# Altium project UU001_UUControl.PrjPcb
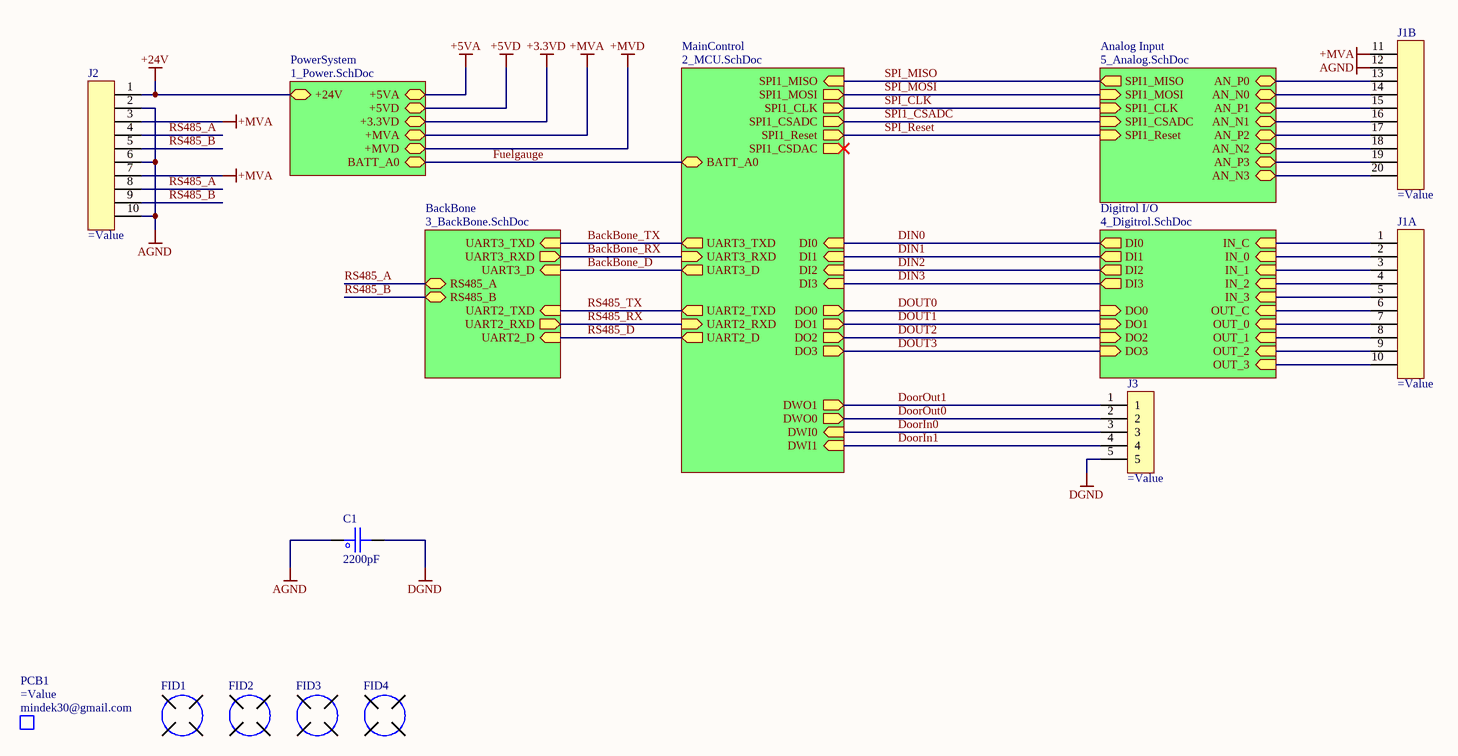
[diagram p0: 0_Overview.SchDoc]
PCB_Name: UU Control Board; PCB_PN: UU001; PCB_Rev: A1; PCBA_PN: UU001; PCBA_Rev: A1
6 sheets, 204 parts. Net scope: hierarchical (ports join the sheet entries above them; power ports are global).
Board file: UU001_UUControl.PcbDoc
Sheets:
  0_Overview.SchDoc
    MainControl = 2_MCU.SchDoc
    Analog Input = 5_Analog.SchDoc
    Digitrol I/O = 4_Digitrol.SchDoc
    PowerSystem = 1_Power.SchDoc
    BackBone = 3_BackBone.SchDoc

## Sheet 0_Overview.SchDoc: Overview
size A3; DocumentNumber: 1; SheetNumber: 1; SheetTotal: 6; PageSetup: Record=PageOptions|CenterHorizontal=True|CenterVertical=True|PrintScale=1.01|XCorrection=1.00|YCorrection=1.00|PrintKind=0|BorderSize=5000000|LeftOffset=0|BottomOffset=0|Orientation=2|PaperLength=1000|PaperWidth=1000|Scale=100|PaperSource=7|PrintQuality=-4|MediaType=1|DitherType=10|PaperKind=A3|PrintScaleMode=1

### Parts
C1  2200pF  [C_1206]
FID1  FIDUCIAL  [FID]  (value not drawn)  (no BOM)
FID2  FIDUCIAL  [FID]  (value not drawn)  (no BOM)
FID3  FIDUCIAL  [FID]  (value not drawn)  (no BOM)
FID4  FIDUCIAL  [FID]  (value not drawn)  (no BOM)
J1  (no value)  [CON_20P_Terminal]  (parts A,B of 2)
J2  (no value)  [CON_10P_Terminal]
J3  (no value)  [MOLEX_532610571]
PCB1  Manufacturer: mindek30@gmail.com  (mechanical)

### Sub-sheets
Analog Input = 5_Analog.SchDoc: SPI1_MISO (out), SPI1_MOSI (in), SPI1_CLK (in), SPI1_CSADC (in), SPI1_Reset (in), AN_P0 (bidir), AN_P1 (bidir), AN_P2 (bidir), AN_P3 (bidir), AN_N0 (bidir), AN_N1 (bidir), AN_N2 (bidir), AN_N3 (bidir)
BackBone = 3_BackBone.SchDoc: UART3_D (in), UART2_TXD (in), UART2_RXD (out), UART2_D (in), UART3_TXD (in), UART3_RXD (out), RS485_A (bidir), RS485_B (bidir)
Digitrol I/O = 4_Digitrol.SchDoc: DI0 (out), DI1 (out), DI2 (out), DI3 (out), DO0 (in), DO1 (in), DO2 (in), DO3 (in), IN_0 (in), IN_1 (in), IN_2 (in), IN_3 (in), OUT_0 (in), OUT_1 (in), OUT_2 (in), OUT_3 (in), OUT_C (in), IN_C (in)
MainControl = 2_MCU.SchDoc: SPI1_MISO (in), SPI1_MOSI (out), SPI1_CLK (out), DI0 (in), DI1 (in), DI2 (in), DI3 (in), DO0 (out), DO1 (out), DO2 (out), DO3 (out), SPI1_Reset (out), UART3_TXD (out), UART3_RXD (in), UART3_D (out), UART2_TXD (out), UART2_RXD (in), UART2_D (out), BATT_A0 (bidir), SPI1_CSADC (out), SPI1_CSDAC (out), DWO0 (out), DWI1 (in), DWI0 (in), DWO1 (out)
PowerSystem = 1_Power.SchDoc: +5VA (bidir), +24V (bidir), +3.3VD (bidir), +MVA (bidir), +MVD (bidir), BATT_A0 (bidir), +5VD (bidir)

### Nets
+24V: J2.1 ; sheet PowerSystem/+24V
+MVA: J1.11 J2.3 J2.7 ; sheet PowerSystem/+MVA
AGND: C1.1 J1.12 J2.2 J2.6 J2.10
DGND: C1.2 J3.5
BackBone_D: sheet MainControl/UART3_D, sheet BackBone/UART3_D
BackBone_RX: sheet MainControl/UART3_RXD, sheet BackBone/UART3_RXD
BackBone_TX: sheet MainControl/UART3_TXD, sheet BackBone/UART3_TXD
DIN0: sheet MainControl/DI0, sheet Digitrol I/O/DI0
DIN1: sheet MainControl/DI1, sheet Digitrol I/O/DI1
DIN2: sheet MainControl/DI2, sheet Digitrol I/O/DI2
DIN3: sheet MainControl/DI3, sheet Digitrol I/O/DI3
DoorIn0: J3.3 ; sheet MainControl/DWI0
DoorIn1: J3.4 ; sheet MainControl/DWI1
DoorOut0: J3.2 ; sheet MainControl/DWO0
DoorOut1: J3.1 ; sheet MainControl/DWO1
DOUT0: sheet MainControl/DO0, sheet Digitrol I/O/DO0
DOUT1: sheet MainControl/DO1, sheet Digitrol I/O/DO1
DOUT2: sheet MainControl/DO2, sheet Digitrol I/O/DO2
DOUT3: sheet MainControl/DO3, sheet Digitrol I/O/DO3
Fuelgauge: sheet MainControl/BATT_A0, sheet PowerSystem/BATT_A0
INCom: J1.1 ; sheet Digitrol I/O/IN_C
INPUT0: J1.2 ; sheet Digitrol I/O/IN_0
INPUT1: J1.3 ; sheet Digitrol I/O/IN_1
INPUT2: J1.4 ; sheet Digitrol I/O/IN_2
INPUT3: J1.5 ; sheet Digitrol I/O/IN_3
OUTCom: J1.6 ; sheet Digitrol I/O/OUT_C
OUTPUT0: J1.7 ; sheet Digitrol I/O/OUT_0
OUTPUT1: J1.8 ; sheet Digitrol I/O/OUT_1
OUTPUT2: J1.9 ; sheet Digitrol I/O/OUT_2
OUTPUT3: J1.10 ; sheet Digitrol I/O/OUT_3
RS485_A: J2.4 J2.8 ; sheet BackBone/RS485_A
RS485_B: J2.5 J2.9 ; sheet BackBone/RS485_B
RS485_D: sheet MainControl/UART2_D, sheet BackBone/UART2_D
RS485_RX: sheet MainControl/UART2_RXD, sheet BackBone/UART2_RXD
RS485_TX: sheet MainControl/UART2_TXD, sheet BackBone/UART2_TXD
SPI1_CSADC: sheet MainControl/SPI1_CSADC, sheet Analog Input/SPI1_CSADC
SPI_CLK: sheet MainControl/SPI1_CLK, sheet Analog Input/SPI1_CLK  [project net SPI1_SCK]
SPI_MISO: sheet MainControl/SPI1_MISO, sheet Analog Input/SPI1_MISO  [project net SPI1_MISO]
SPI_MOSI: sheet MainControl/SPI1_MOSI, sheet Analog Input/SPI1_MOSI  [project net SPI1_MOSI]
SPI_Reset: sheet MainControl/SPI1_Reset, sheet Analog Input/SPI1_Reset
NetJ1_13: J1.13 ; sheet Analog Input/AN_P0
NetJ1_14: J1.14 ; sheet Analog Input/AN_N0
NetJ1_15: J1.15 ; sheet Analog Input/AN_P1
NetJ1_16: J1.16 ; sheet Analog Input/AN_N1
NetJ1_17: J1.17 ; sheet Analog Input/AN_P2
NetJ1_18: J1.18 ; sheet Analog Input/AN_N2
NetJ1_19: J1.19 ; sheet Analog Input/AN_P3
NetJ1_20: J1.20 ; sheet Analog Input/AN_N3

### Notes on the sheet
- Title :
- Revision :
- ผู้จัดทำ:
- Size:
- A3
- Time:
- ผู้เขียน:
- บริษัท ยูนิเวอร์แซล ยูทีลิตี้ส์ จำกัด (มหาชน) เลขที่ 1 อาคาร อีสท์วอเตอร์ ชั้น 18 ซอยวิภาวดีรังสิต 5 แขวงจอมพล เขตจตุจักร กรุงเทพฯ 10900
  Tel : +662-272-1688
  Fax :+662-2721690-1
- -
- Sheet:
- of
- ผู้อำนวยการ
- ผู้ตรวจสอบ:
- Number:
- กรรมการผู้จัดการ:
- File:

### Library data of the parts
C1 = C_Capacitor: CAP CER 2200PF 1KV X7R 1206; Manufacturer: AVX Corporation; PartNumber: 1206AC222KAT1A; PackageReference: 1206; PartID: 478-2953-1-ND; Value2: 1kV; Value: 2200pF; Value3: *
FID1-FID4 = FID_FIDUCIAL: Manufacturer: mindek30@gmail.com; PartNumber: UU001_A1; Value2: Non SE; Value: Non SE; PartID: A1; PackageReference: Non SE; Value3: Non SE
J1 = CON_20P_Terminal: TERM BLOCK HDR 20POS 90DEG 3.5MM; PartNumber: KF2EDGK-20P; Value: KF2EDGK-20P; Value3: 1966172; PartID: KF2EDGK-20P; Manufacturer: *; PackageReference: *; Value2: *
J2 = CON_10P_Terminal: TERM BLOCK HDR 10POS 90DEG 3.5MM; PartNumber: KF2EDGK-10P; Value: KF2EDGK-10P; Value3: 1966172; PartID: KF2EDGK-10P; Manufacturer: *; PackageReference: *; Value2: *
J3 = CON_5P_532610571: CONN HEADER SMD R/A 5POS 1.25MM; PartNumber: 0532610571; Manufacturer: Molex; Value: 0532610571; Value2: AFC12-S05DCC-00; PartID: WM7623CT-ND; PackageReference: 5P; Value3: *
PCB1 = PCB_Bare: BARE PCB; PartNumber: UU001_A1; PackageReference: Non SE; PartID: A1; Value2: =JobFile_Title; Value: =PartNumber; Value3: UU001_A1

## Sheet 2_MCU.SchDoc
size A3; DocumentNumber: 3; SheetNumber: 3; SheetTotal: 6; PageSetup: Record=PageOptions|CenterHorizontal=True|CenterVertical=True|PrintScale=1.01|XCorrection=1.00|YCorrection=1.00|PrintKind=0|BorderSize=5000000|LeftOffset=0|BottomOffset=0|Orientation=2|PaperLength=1000|PaperWidth=1000|Scale=100|PaperSource=7|PrintQuality=-4|MediaType=1|DitherType=10|PaperKind=A3|PrintScaleMode=1
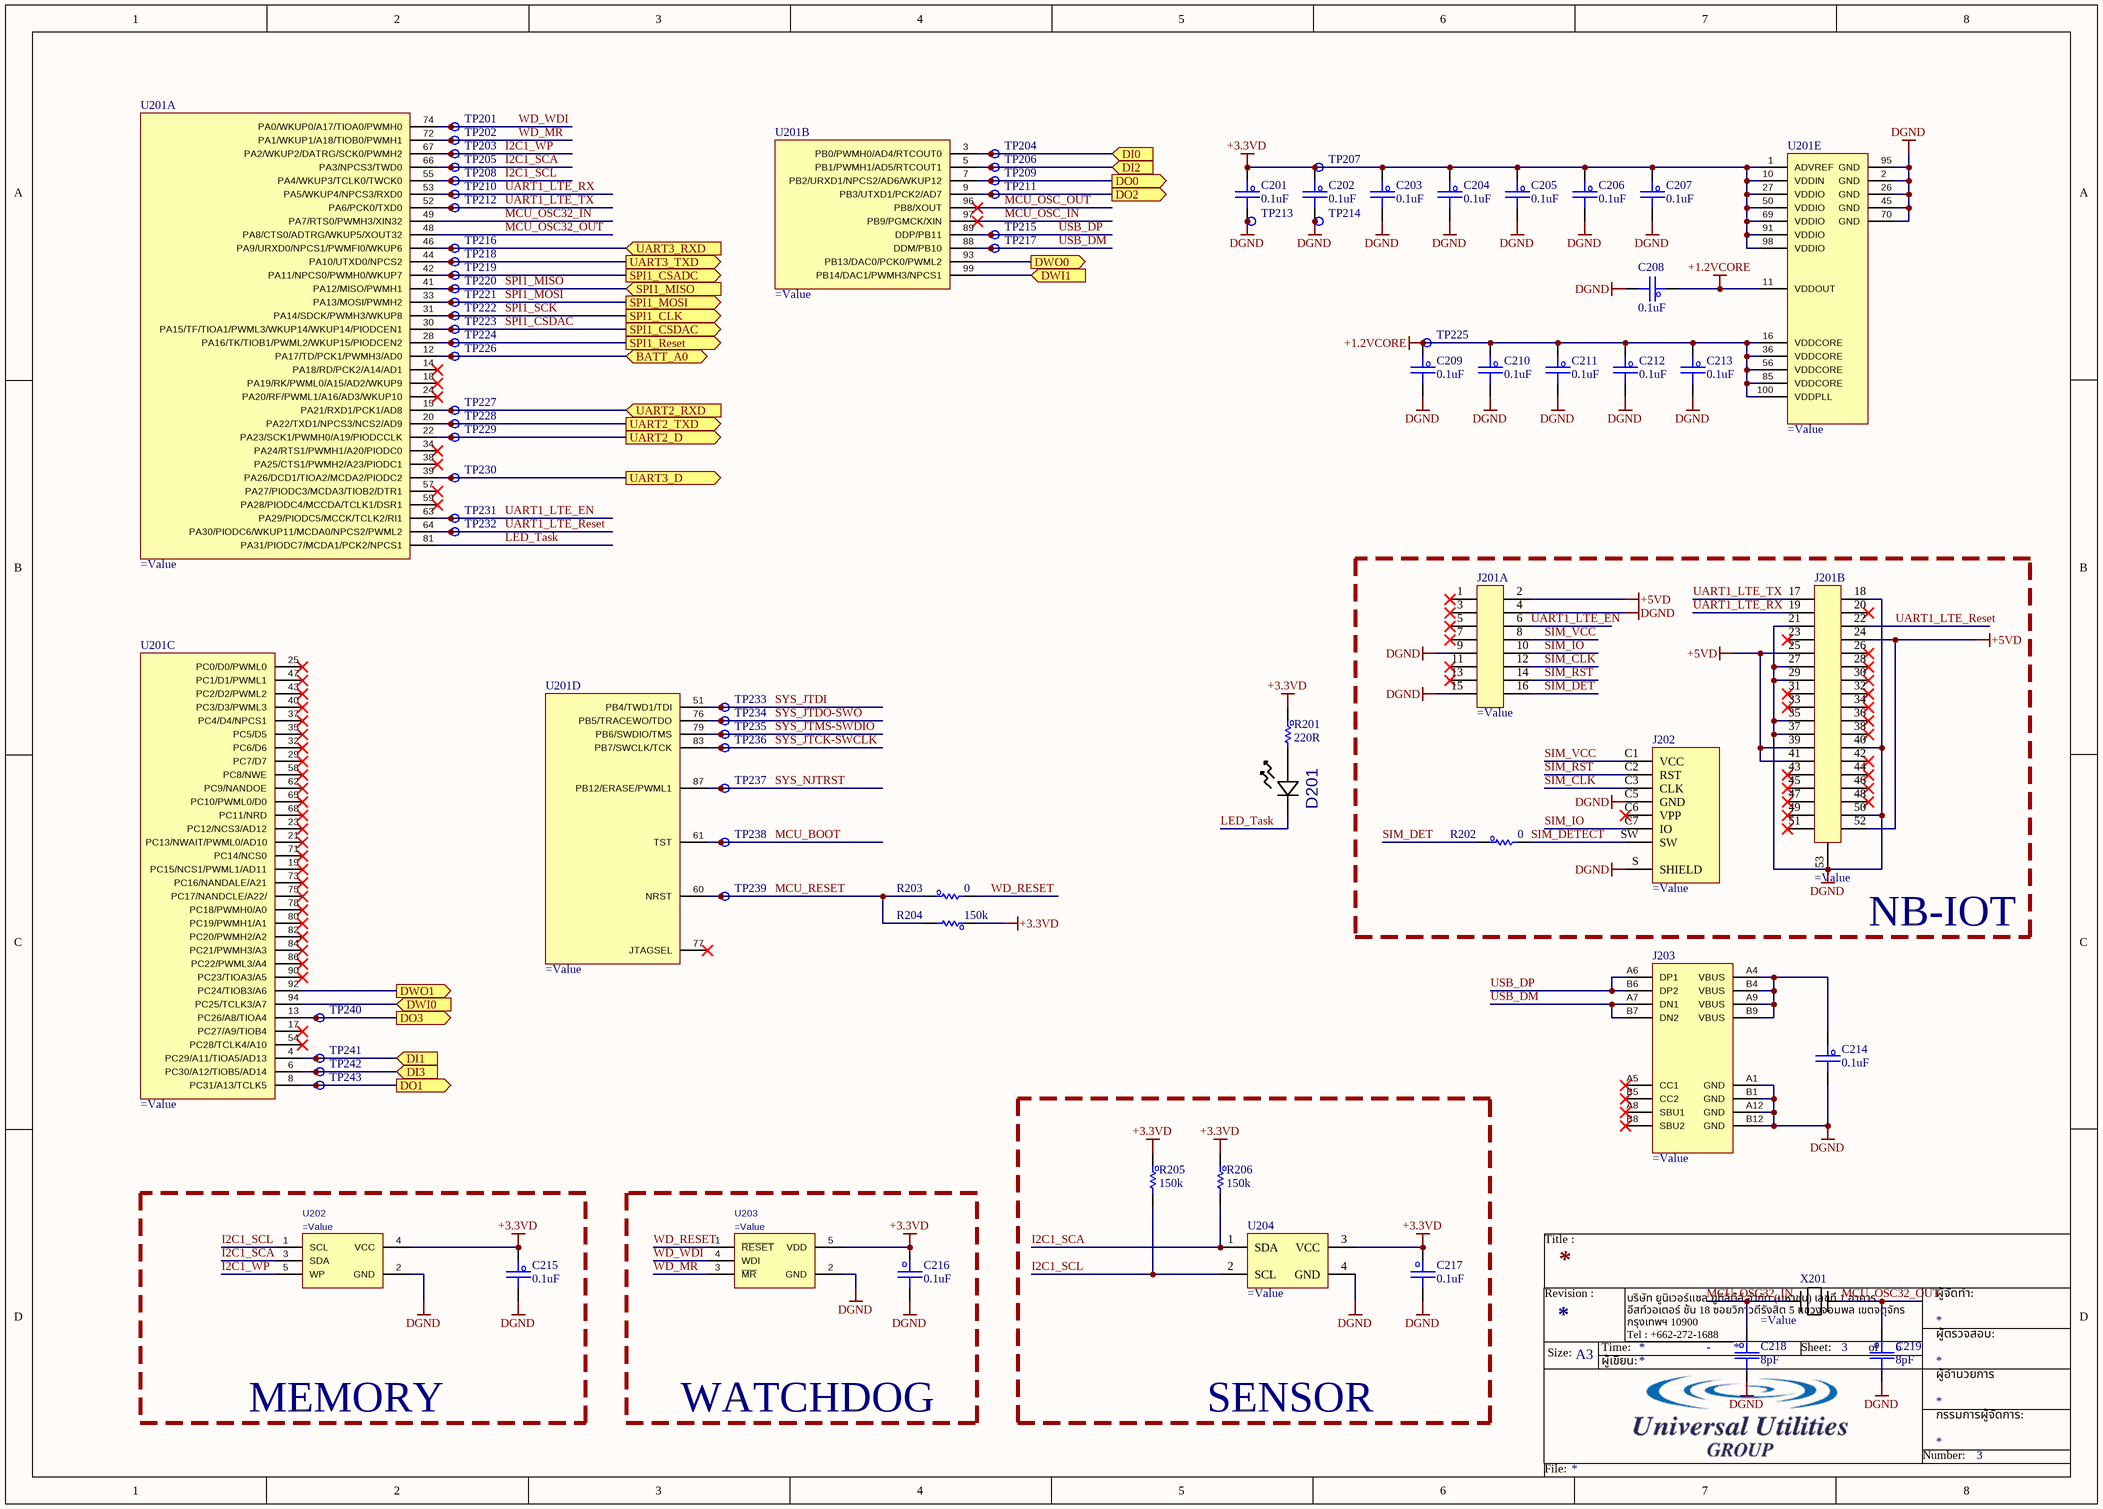
[diagram p1: 2_MCU.SchDoc]

### Parts
C201  0.1uF  [C_0603]
C202  0.1uF  [C_0603]
C203  0.1uF  [C_0603]
C204  0.1uF  [C_0603]
C205  0.1uF  [C_0603]
C206  0.1uF  [C_0603]
C207  0.1uF  [C_0603]
C208  0.1uF  [C_0603]
C209  0.1uF  [C_0603]
C210  0.1uF  [C_0603]
C211  0.1uF  [C_0603]
C212  0.1uF  [C_0603]
C213  0.1uF  [C_0603]
C214  0.1uF  [C_0603]
C215  0.1uF  [C_0603]
C216  0.1uF  [C_0603]
C217  0.1uF  [C_0603]
C218  8pF  [C_0603]  (no BOM)
C219  8pF  [C_0603]  (no BOM)
D201  (no value)  [LED_0VS75000_WRE]
J201  (no value)  [TE_2041119-1]  (parts A,B of 2)
J202  (no value)  [SIM8060-6-1-14-00-A_REVA]
J203  (no value)  [2137160001_MOL_2137160001(Primary)]
R201  220R  [R_0603]
R202  0  [R_0603]
R203  0  [R_0603]
R204  150k  [R_0603]
R205  150k  [R_0603]
R206  150k  [R_0603]
TP201  (no value)  [TP_Testpoint]  (no BOM)
TP202  (no value)  [TP_Testpoint]  (no BOM)
TP203  (no value)  [TP_Testpoint]  (no BOM)
TP204  (no value)  [TP_Testpoint]  (no BOM)
TP205  (no value)  [TP_Testpoint]  (no BOM)
TP206  (no value)  [TP_Testpoint]  (no BOM)
TP207  (no value)  [TP_Testpoint]  (no BOM)
TP208  (no value)  [TP_Testpoint]  (no BOM)
TP209  (no value)  [TP_Testpoint]  (no BOM)
TP210  (no value)  [TP_Testpoint]  (no BOM)
TP211  (no value)  [TP_Testpoint]  (no BOM)
TP212  (no value)  [TP_Testpoint]  (no BOM)
TP213  (no value)  [TP_Testpoint]  (no BOM)
TP214  (no value)  [TP_Testpoint]  (no BOM)
TP215  (no value)  [TP_Testpoint]  (no BOM)
TP216  (no value)  [TP_Testpoint]  (no BOM)
TP217  (no value)  [TP_Testpoint]  (no BOM)
TP218  (no value)  [TP_Testpoint]  (no BOM)
TP219  (no value)  [TP_Testpoint]  (no BOM)
TP220  (no value)  [TP_Testpoint]  (no BOM)
TP221  (no value)  [TP_Testpoint]  (no BOM)
TP222  (no value)  [TP_Testpoint]  (no BOM)
TP223  (no value)  [TP_Testpoint]  (no BOM)
TP224  (no value)  [TP_Testpoint]  (no BOM)
TP225  (no value)  [TP_Testpoint]  (no BOM)
TP226  (no value)  [TP_Testpoint]  (no BOM)
TP227  (no value)  [TP_Testpoint]  (no BOM)
TP228  (no value)  [TP_Testpoint]  (no BOM)
TP229  (no value)  [TP_Testpoint]  (no BOM)
TP230  (no value)  [TP_Testpoint]  (no BOM)
TP231  (no value)  [TP_Testpoint]  (no BOM)
TP232  (no value)  [TP_Testpoint]  (no BOM)
TP233  (no value)  [TP_Testpoint]  (no BOM)
TP234  (no value)  [TP_Testpoint]  (no BOM)
TP235  (no value)  [TP_Testpoint]  (no BOM)
TP236  (no value)  [TP_Testpoint]  (no BOM)
TP237  (no value)  [TP_Testpoint]  (no BOM)
TP238  (no value)  [TP_Testpoint]  (no BOM)
TP239  (no value)  [TP_Testpoint]  (no BOM)
TP240  (no value)  [TP_Testpoint]  (no BOM)
TP241  (no value)  [TP_Testpoint]  (no BOM)
TP242  (no value)  [TP_Testpoint]  (no BOM)
TP243  (no value)  [TP_Testpoint]  (no BOM)
U201  (no value)  [TQFP100_14X14M00]  (parts A,B,C,D,E of 5)
U202  (no value)  [SOT65P210X110-5N]
U203  (no value)  [DBV5]
U204  (no value)  [XDCR_SHT40-AD1B-R2]
X201  (no value)  [XTAL_CM315D_CF00]  (no BOM)

### Blocks framed on the sheet
NB-IOT: J201 J202 R202
SENSOR: C217 R205 R206 U204
MEMORY: C215 U202
WATCHDOG: C216 U203

### Ports
BATT_A0 (bidir), DI0 (in), DI1 (in), DI2 (in), DI3 (in), DO0 (out), DO1 (out), DO2 (out), DO3 (out), DWI0 (in), DWI1 (in), DWO0 (out), DWO1 (out), SPI1_CLK (out), SPI1_CSADC (out), SPI1_CSDAC (out), SPI1_MISO (in), SPI1_MOSI (out), SPI1_Reset (out), UART2_D (out), UART2_RXD (in), UART2_TXD (out), UART3_D (out), UART3_RXD (in), UART3_TXD (out)

### Nets
+1.2VCORE: C208.1 C209.1 C210.1 C211.1 C212.1 C213.1 TP225.1 U201.11(VDDOUT) U201.16(VDDCORE) U201.36(VDDCORE) U201.56(VDDCORE) U201.85(VDDCORE) U201.100(VDDPLL)
+3.3VD: C201.1 C202.1 C203.1 C204.1 C205.1 C206.1 C207.1 C215.1 C216.1 C217.1 R201.1 R204.1 R205.1 R206.1 TP207.1 U201.1(ADVREF) U201.10(VDDIN) U201.27(VDDIO) U201.50(VDDIO) U201.69(VDDIO) U201.91(VDDIO) U201.98(VDDIO) U202.4(VCC) U203.5(VDD) U204.3(VCC)
+5VD: J201.2 J201.24 J201.25 J201.39 J201.41 J201.52
DGND: C201.2 C202.2 C203.2 C204.2 C205.2 C206.2 C207.2 C208.2 C209.2 C210.2 C211.2 C212.2 C213.2 C214.2 C215.2 C216.2 C217.2 C218.2 C219.2 J201.4 J201.9 J201.15 J201.18 J201.21 J201.27 J201.29 J201.35 J201.37 J201.40 J201.50 J201.53 J202.C5(GND) J202.S(SHIELD) J203.A1(GND) J203.A12(GND) J203.B1(GND) J203.B12(GND) TP213.1 TP214.1 U201.2(GND) U201.26(GND) U201.45(GND) U201.70(GND) U201.95(GND) U202.2(GND) U203.2(GND) U204.4(GND)
BackBone_D: TP230.1 U201.39(PA26/DCD1/TIOA2/MCDA2/PIODC2) ; port UART3_D
BackBone_RX: TP216.1 U201.46(PA9/URXD0/NPCS1/PWMFI0/WKUP6) ; port UART3_RXD
BackBone_TX: TP218.1 U201.44(PA10/UTXD0/NPCS2) ; port UART3_TXD
DIN0: TP204.1 U201.3(PB0/PWMH0/AD4/RTCOUT0) ; port DI0
DIN1: TP241.1 U201.4(PC29/A11/TIOA5/AD13) ; port DI1
DIN2: TP206.1 U201.5(PB1/PWMH1/AD5/RTCOUT1) ; port DI2
DIN3: TP242.1 U201.6(PC30/A12/TIOB5/AD14) ; port DI3
DoorIn0: U201.94(PC25/TCLK3/A7) ; port DWI0
DoorIn1: U201.99(PB14/DAC1/PWMH3/NPCS1) ; port DWI1
DoorOut0: U201.93(PB13/DAC0/PCK0/PWML2) ; port DWO0
DoorOut1: U201.92(PC24/TIOB3/A6) ; port DWO1
DOUT0: TP209.1 U201.7(PB2/URXD1/NPCS2/AD6/WKUP12) ; port DO0
DOUT1: TP243.1 U201.8(PC31/A13/TCLK5) ; port DO1
DOUT2: TP211.1 U201.9(PB3/UTXD1/PCK2/AD7) ; port DO2
DOUT3: TP240.1 U201.13(PC26/A8/TIOA4) ; port DO3
Fuelgauge: TP226.1 U201.12(PA17/TD/PCK1/PWMH3/AD0) ; port BATT_A0
I2C1_SCA: R206.2 TP205.1 U201.66(PA3/NPCS3/TWD0) U202.3(SDA) U204.1(SDA)
I2C1_SCL: R205.2 TP208.1 U201.55(PA4/WKUP3/TCLK0/TWCK0) U202.1(SCL) U204.2(SCL)
I2C1_WP: TP203.1 U201.67(PA2/WKUP2/DATRG/SCK0/PWMH2) U202.5(WP)
LED_Task: D201.1 U201.81(PA31/PIODC7/MCDA1/PCK2/NPCS1)
MCU_BOOT: TP238.1 U201.61(TST)
MCU_OSC32_IN: C218.1 U201.49(PA7/RTS0/PWMH3/XIN32) X201.1
MCU_OSC32_OUT: C219.1 U201.48(PA8/CTS0/ADTRG/WKUP5/XOUT32) X201.2
MCU_OSC_IN: U201.97(PB9/PGMCK/XIN)
MCU_OSC_OUT: U201.96(PB8/XOUT)
MCU_RESET: R203.1 R204.2 TP239.1 U201.60(NRST)
RS485_D: TP229.1 U201.22(PA23/SCK1/PWMH0/A19/PIODCCLK) ; port UART2_D
RS485_RX: TP227.1 U201.15(PA21/RXD1/PCK1/AD8) ; port UART2_RXD
RS485_TX: TP228.1 U201.20(PA22/TXD1/NPCS3/NCS2/AD9) ; port UART2_TXD
SIM_CLK: J201.12 J202.C3(CLK)
SIM_DET: J201.16 R202.1
SIM_DETECT: J202.SW R202.2
SIM_IO: J201.10 J202.C7(IO)
SIM_RST: J201.14 J202.C2(RST)
SIM_VCC: J201.8 J202.C1(VCC)
SPI1_CSADC: TP219.1 U201.42(PA11/NPCS0/PWMH0/WKUP7) ; port SPI1_CSADC
SPI1_CSDAC: TP223.1 U201.30(PA15/TF/TIOA1/PWML3/WKUP14/WKUP14/PIODCEN1) ; port SPI1_CSDAC
SPI1_MISO: TP220.1 U201.41(PA12/MISO/PWMH1) ; port SPI1_MISO
SPI1_MOSI: TP221.1 U201.33(PA13/MOSI/PWMH2) ; port SPI1_MOSI
SPI1_SCK: TP222.1 U201.31(PA14/SDCK/PWMH3/WKUP8) ; port SPI1_CLK
SPI_Reset: TP224.1 U201.28(PA16/TK/TIOB1/PWML2/WKUP15/PIODCEN2) ; port SPI1_Reset
SYS_JTCK-SWCLK: TP236.1 U201.83(PB7/SWCLK/TCK)
SYS_JTDI: TP233.1 U201.51(PB4/TWD1/TDI)
SYS_JTDO-SWO: TP234.1 U201.76(PB5/TRACEWO/TDO)
SYS_JTMS-SWDIO: TP235.1 U201.79(PB6/SWDIO/TMS)
SYS_NJTRST: TP237.1 U201.87(PB12/ERASE/PWML1)
UART1_LTE_EN: J201.6 TP231.1 U201.63(PA29/PIODC5/MCCK/TCLK2/RI1)
UART1_LTE_Reset: J201.22 TP232.1 U201.64(PA30/PIODC6/WKUP11/MCDA0/NPCS2/PWML2)
UART1_LTE_RX: J201.19 TP210.1 U201.53(PA5/WKUP4/NPCS3/RXD0)
UART1_LTE_TX: J201.17 TP212.1 U201.52(PA6/PCK0/TXD0)
USB_DM: J203.A7(DN1) J203.B7(DN2) TP217.1 U201.88(DDM/PB10)
USB_DP: J203.A6(DP1) J203.B6(DP2) TP215.1 U201.89(DDP/PB11)
WD_MR: TP202.1 U201.72(PA1/WKUP1/A18/TIOB0/PWMH1) U203.3(~{MR})
WD_RESET: R203.2 U203.1(~{RESET})
WD_WDI: TP201.1 U201.74(PA0/WKUP0/A17/TIOA0/PWMH0) U203.4(WDI)
NetC214_1: C214.1 J203.A4(VBUS) J203.A9(VBUS) J203.B4(VBUS) J203.B9(VBUS)
NetD201_2: D201.2 R201.2

Not connected (* = marked no-connect by the designer): J201 1* 3* 5* 7* 11* 13* 20* 23* 26* 28* 30* 31* 32* 33* 34* 36* 38* 42* 43* 44* 45* 46* 47* 48* 49* 51*; J202 C6(VPP)*; J203 A5(CC1)* A8(SBU1)* B5(CC2)* B8(SBU2)*; U201 14(PA18/RD/PCK2/A14/AD1)* 17(PC27/A9/TIOB4)* 18(PA19/RK/PWML0/A15/AD2/WKUP9)* 19(PC15/NCS1/PWML1/AD11)* 21(PC13/NWAIT/PWML0/AD10)* 23(PC12/NCS3/AD12)* 24(PA20/RF/PWML1/A16/AD3/WKUP10)* 25(PC0/D0/PWML0)* 29(PC7/D7)* 32(PC6/D6)* 34(PA24/RTS1/PWMH1/A20/PIODC0)* 35(PC5/D5)* 37(PC4/D4/NPCS1)* 38(PA25/CTS1/PWMH2/A23/PIODC1)* 40(PC3/D3/PWML3)* 43(PC2/D2/PWML2)* 47(PC1/D1/PWML1)* 54(PC28/TCLK4/A10)* 57(PA27/PIODC3/MCDA3/TIOB2/DTR1)* 58(PC8/NWE)* 59(PA28/PIODC4/MCCDA/TCLK1/DSR1)* 62(PC9/NANDOE)* 65(PC10/PWML0/D0)* 68(PC11/NRD)* 71(PC14/NCS0)* 73(PC16/NANDALE/A21)* 75(PC17/NANDCLE/A22/)* 77(JTAGSEL)* 78(PC18/PWMH0/A0)* 80(PC19/PWMH1/A1)* 82(PC20/PWMH2/A2)* 84(PC21/PWMH3/A3)* 86(PC22/PWML3/A4)* 90(PC23/TIOA3/A5)*

### Notes on the sheet
- Title :
- Revision :
- ผู้จัดทำ:
- Size:
- A3
- Time:
- ผู้เขียน:
- บริษัท ยูนิเวอร์แซล ยูทีลิตี้ส์ จำกัด (มหาชน) เลขที่ 1 อาคาร อีสท์วอเตอร์ ชั้น 18 ซอยวิภาวดีรังสิต 5 แขวงจอมพล เขตจตุจักร กรุงเทพฯ 10900
  Tel : +662-272-1688
  Fax :+662-2721690-1
- -
- Sheet:
- of
- ผู้อำนวยการ
- ผู้ตรวจสอบ:
- Number:
- กรรมการผู้จัดการ:
- File:

### Library data of the parts
C201-C217 = C_Capacitor: CAP CER 0.1UF 50V X7R 0603; Manufacturer: KEMET; PartNumber: C0603C104K5RACTU; PackageReference: 0603; PartID: 399-5089-1-ND; Value2: 50V; Value: 0.1uF; Value3: *
C218 C219 = C_Capacitor: Capacitor; Manufacturer: KEMET; PartNumber: CBR06C809B5GAC; Value2: 6.3V; PackageReference: 0603; PartID: 399-CBR06C809B5GACCT-ND; Value: 8pF; Value3: *
D201 = D_LED_150060BS75000: LED BLUE CLEAR 0603 SMD; Manufacturer: Wurth Electronics; Value: 150060VS75000; PackageReference: 0603; PartID: 732-4980-1-ND; PartNumber: 150060VS75000
J201 = CON_PCI-E-52P: CONN PCI EXP MINI FEMALE 52POS; PartNumber: 2041119-1; Manufacturer: TE Connectivity AMP Connectors; Value: 2041119-1; PartID: A108265CT-ND; PackageReference: *; Value2: *; Value3: *
J202 = CON_SIM_Nano_Top: CONN SIM NANO HINGED 6P W/SWITCH; PartNumber: SIM8060-6-1-14-00-A; Manufacturer: GCT; Value: SIM8060-6-1-14-00-A; PartID: 640-SIM8060611400A; PackageReference: *; Value2: *; Value3: *
J203 = CON_USBC: CONN RCPT USB2.0 TYPE C 24POS RA; PartNumber: 2137160001; Manufacturer: Molex; Value: 2137160001; PartID: 900-2137160001CT-ND; PackageReference: *; Value2: *; Value3: *
R201 = R_Resister: RES SMD 220 OHM 1% 1/10W 0603; Manufacturer: Vishay Dale; PartNumber: CRCW0603220RFKEAC; Value2: 0.1W; Value: 220R; PackageReference: 0603; PartID: 541-4047-1-ND; Value3: *
R202 R203 = R_Resister: RES SMD 0 OHM JUMP 1/10W 0603; Manufacturer: Vishay Dale; PartNumber: CRCW06030000Z0EBC; Value2: 0.1W; Value: 0; PackageReference: 0603; PartID: 541-4013-1-ND; Value3: *
R204-R206 = R_Resister: RES SMD 150K OHM 1% 1/10W 0603; Manufacturer: Vishay Dale; PartNumber: CRCW0603150KFKEAC; Value2: 0.1W; Value: 150k; PackageReference: 0603; PartID: 541-4034-1-ND; Value3: *
TP201-TP243 = TP_TestPoint: TestPoint; Manufacturer: *; PackageReference: *; PartID: *; PartNumber: *; Value2: *; Value3: *
U201 = IC_MCU_ATSAM4SA16CA: IC MCU 32BIT 1MB FLASH 100LQFP; Manufacturer: Microchip Technology; PartNumber: ATSAM4SA16CA-AUR; Value: ATSAM4SA16CA-AUR; PackageReference: 100-LQFP; PartID: ATSAM4SA16CA-AURCT-ND
U202 = IC_MEM_24AA02HT: IC EEPROM 2KBIT I2C SC70-5; Manufacturer: Microchip Technology; Value: 24AA02HT-I/LT; PackageReference: SC-70-5; PartID: 24AA02HT-I/LTCT-ND; PartNumber: 24AA02HT-I/LT
U203 = IC_WDT_TPS3828-33DBVTG4: Processor Supervisory Circuits; Manufacturer: Texas Instruments; Value: TPS3828-33DBVTG4; PackageReference: SOT-23; PartID: 296-52797-1-ND; PartNumber: TPS3828-33DBVTG4
U204 = IC_SEN_SHT40-AD1B-R3: SENSOR HUMIDITY 100 RH SMD; Manufacturer: Sensirion AG; PartNumber: SHT40-AD1B-R3; PartID: 1649-SHT40-AD1B-R3CT-ND; PackageReference: QFN-4; Value: SHT40-AD1B-R3; Value2: *; Value3: *
X201 = X_32_768MHz: CRYSTAL 32.7680KHZ 7PF SMD; PartNumber: CM315D32768DZYT; Manufacturer: Citizen Finedevice Co Ltd; Value: CM315D32768DZYT; PartID: 300-8815-1-ND; PackageReference: *; Value2: *; Value3: *

## Sheet 5_Analog.SchDoc
size A3; DocumentNumber: 6; SheetNumber: 6; SheetTotal: 6
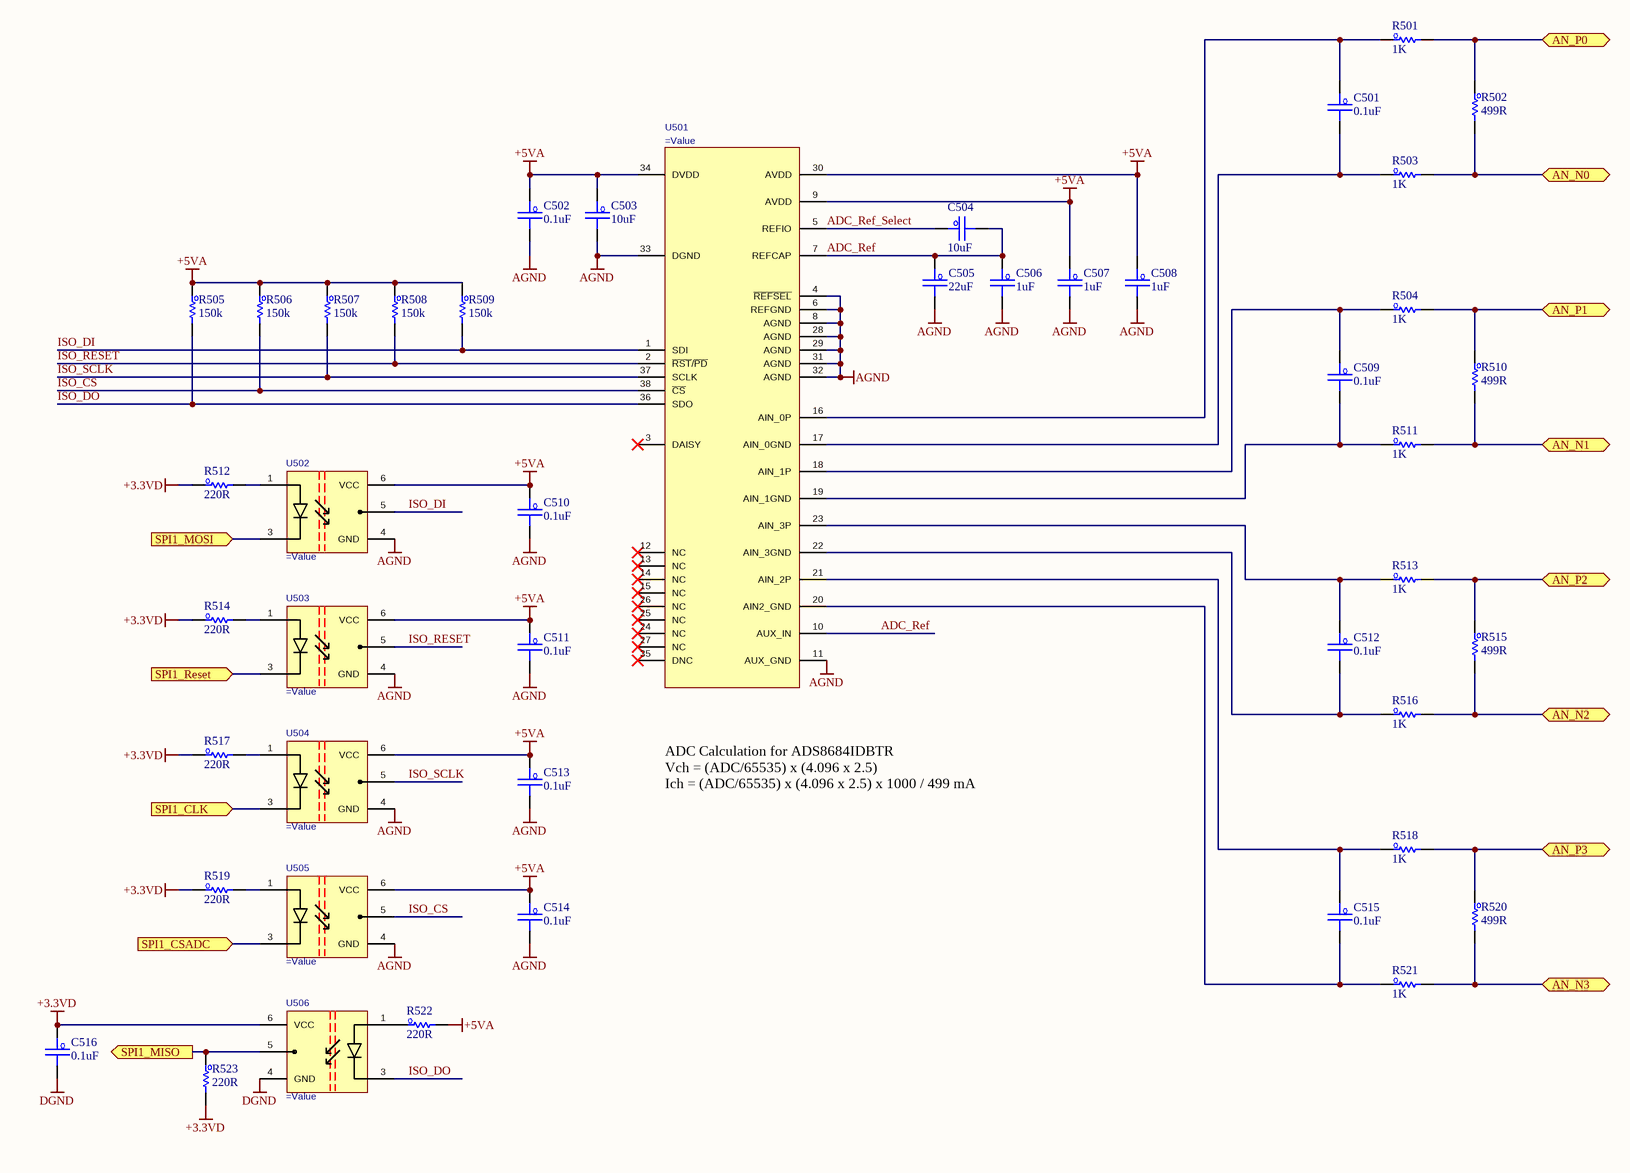
[diagram p2: 5_Analog.SchDoc]

### Parts
C501  0.1uF  [C_0603]
C502  0.1uF  [C_0603]
C503  10uF  [C_0603]
C504  10uF  [C_0603]
C505  22uF  [C_0603]
C506  1uF  [C_0603]
C507  1uF  [C_0603]
C508  1uF  [C_0603]
C509  0.1uF  [C_0603]
C510  0.1uF  [C_0603]
C511  0.1uF  [C_0603]
C512  0.1uF  [C_0603]
C513  0.1uF  [C_0603]
C514  0.1uF  [C_0603]
C515  0.1uF  [C_0603]
C516  0.1uF  [C_0603]
R501  1K  [R_0603]
R502  499R  [R_0603]
R503  1K  [R_0603]
R504  1K  [R_0603]
R505  150k  [R_0603]
R506  150k  [R_0603]
R507  150k  [R_0603]
R508  150k  [R_0603]
R509  150k  [R_0603]
R510  499R  [R_0603]
R511  1K  [R_0603]
R512  220R  [R_0603]
R513  1K  [R_0603]
R514  220R  [R_0603]
R515  499R  [R_0603]
R516  1K  [R_0603]
R517  220R  [R_0603]
R518  1K  [R_0603]
R519  220R  [R_0603]
R520  499R  [R_0603]
R521  1K  [R_0603]
R522  220R  [R_0603]
R523  220R  [R_0603]
U501  (no value)  [DBT0038A_N_TEX]
U502  (no value)  [5PIN SO6_TOS]
U503  (no value)  [5PIN SO6_TOS]
U504  (no value)  [5PIN SO6_TOS]
U505  (no value)  [5PIN SO6_TOS]
U506  (no value)  [5PIN SO6_TOS]

### Ports
AN_N0 (bidir), AN_N1 (bidir), AN_N2 (bidir), AN_N3 (bidir), AN_P0 (bidir), AN_P1 (bidir), AN_P2 (bidir), AN_P3 (bidir), SPI1_CLK (in), SPI1_CSADC (in), SPI1_MISO (out), SPI1_MOSI (in), SPI1_Reset (in)

### Nets
+3.3VD: C516.1 R512.1 R514.1 R517.1 R519.1 R523.2 U506.6(VCC)
+5VA: C502.1 C503.1 C507.1 C508.1 C510.1 C511.1 C513.1 C514.1 R505.1 R506.1 R507.1 R508.1 R509.1 R522.2 U501.9(AVDD) U501.30(AVDD) U501.34(DVDD) U502.6(VCC) U503.6(VCC) U504.6(VCC) U505.6(VCC)
AGND: C502.2 C503.2 C505.2 C506.2 C507.2 C508.2 C510.2 C511.2 C513.2 C514.2 U501.4(~{REFSEL}) U501.6(REFGND) U501.8(AGND) U501.11(AUX_GND) U501.28(AGND) U501.29(AGND) U501.31(AGND) U501.32(AGND) U501.33(DGND) U502.4(GND) U503.4(GND) U504.4(GND) U505.4(GND)
DGND: C516.2 U506.4(GND)
ADC_Ref: C504.2 C505.1 C506.1 U501.7(REFCAP) U501.10(AUX_IN)
ADC_Ref_Select: C504.1 U501.5(REFIO)
ISO_CS: R506.2 U501.38(~{CS}) U505.5(O1)
ISO_DI: R509.2 U501.1(SDI) U502.5(O1)
ISO_DO: R505.2 U501.36(SDO) U506.3(A)
ISO_RESET: R508.2 U501.2(~{RST}/~{PD}) U503.5(O1)
ISO_SCLK: R507.2 U501.37(SCLK) U504.5(O1)
SPI1_CSADC: U505.3(A) ; port SPI1_CSADC
SPI1_MISO: R523.1 U506.5(O1) ; port SPI1_MISO
SPI1_MOSI: U502.3(A) ; port SPI1_MOSI
SPI1_SCK: U504.3(A) ; port SPI1_CLK
SPI_Reset: U503.3(A) ; port SPI1_Reset
NetC501_1: C501.1 R501.1 U501.16(AIN_0P)
NetC501_2: C501.2 R503.1 U501.17(AIN_0GND)
NetC509_1: C509.1 R504.1 U501.18(AIN_1P)
NetC509_2: C509.2 R511.1 U501.19(AIN_1GND)
NetC512_1: C512.1 R513.1 U501.23(AIN_3P)
NetC512_2: C512.2 R516.1 U501.22(AIN_3GND)
NetC515_1: C515.1 R518.1 U501.21(AIN_2P)
NetC515_2: C515.2 R521.1 U501.20(AIN2_GND)
NetJ1_13: R501.2 R502.1 ; port AN_P0
NetJ1_14: R502.2 R503.2 ; port AN_N0
NetJ1_15: R504.2 R510.1 ; port AN_P1
NetJ1_16: R510.2 R511.2 ; port AN_N1
NetJ1_17: R513.2 R515.1 ; port AN_P2
NetJ1_18: R515.2 R516.2 ; port AN_N2
NetJ1_19: R518.2 R520.1 ; port AN_P3
NetJ1_20: R520.2 R521.2 ; port AN_N3
NetR512_2: R512.2 U502.1(A)
NetR514_2: R514.2 U503.1(A)
NetR517_2: R517.2 U504.1(A)
NetR519_2: R519.2 U505.1(A)
NetR522_1: R522.1 U506.1(A)

Not connected (* = marked no-connect by the designer): U501 3(DAISY)* 12(NC)* 13(NC)* 14(NC)* 15(NC)* 24(NC)* 25(NC)* 26(NC)* 27(NC)* 35(DNC)*

### Notes on the sheet
- ADC Calculation for ADS8684IDBTR
  Vch = (ADC/65535) x (4.096 x 2.5)
  Ich = (ADC/65535) x (4.096 x 2.5) x 1000 / 499 mA
- Title :
- Revision :
- ผู้จัดทำ:
- Size:
- A3
- Time:
- ผู้เขียน:
- บริษัท ยูนิเวอร์แซล ยูทีลิตี้ส์ จำกัด (มหาชน) เลขที่ 1 อาคาร อีสท์วอเตอร์ ชั้น 18 ซอยวิภาวดีรังสิต 5 แขวงจอมพล เขตจตุจักร กรุงเทพฯ 10900
  Tel : +662-272-1688
  Fax :+662-2721690-1
- -
- Sheet:
- of
- ผู้อำนวยการ
- ผู้ตรวจสอบ:
- Number:
- กรรมการผู้จัดการ:
- File:

### Library data of the parts
C501 C502 C509-C516 = C_Capacitor: as C201 on sheet 2_MCU; PackageReference: 0603; PartID: 399-5089-1-ND; Value2: 50V; Value: 0.1uF; Value3: *
C503 C504 = C_Capacitor: CAP CER 10UF 10V X6S 0603; Manufacturer: Murata Electronics; PartNumber: GRT188C81A106ME13D; PackageReference: 0603; PartID: 490-12283-1-ND; Value2: 10V; Value: 10uF; Value3: *
C505 = C_Capacitor: CAP CER 22UF 10V X5R 0603; Manufacturer: Murata Electronics; PartNumber: GRM187R61A226ME15D; PackageReference: 0603; PartID: 490-13243-1-ND; Value2: 10V; Value: 22uF; Value3: *
C506-C508 = C_Capacitor: CAP CER 1UF 50V X5R 0603; Manufacturer: Murata Electronics; PartNumber: GRT188R61H105KE13D; PackageReference: 0603; PartID: 490-12330-1-ND; Value2: 50V; Value: 1uF; Value3: *
R501 R503 R504 R511 R513 R516 R518 R521 = R_Resister: RES SMD 1K OHM 5% 1/10W 0603; Manufacturer: Vishay Dale; PartNumber: CRCW06031K00JNEA; Value2: 0.1W; Value: 1K; PackageReference: 0603; PartID: 541-1.0KGCT-ND; Value3: *
R502 R510 R515 R520 = R_Resister: RES SMD 499 OHM 1% 1/3W 0603; Manufacturer: Vishay Dale; PartNumber: CRCW0603499RFKEAHP; Value2: 0.333W; Value: 499R; PackageReference: 0603; PartID: 541-499SCT-ND; Value3: *
R505-R509 = R_Resister: as R204 on sheet 2_MCU; Value: 150k; PackageReference: 0603; PartID: 541-4034-1-ND; Value3: *
R512 R514 R517 R519 R522 R523 = R_Resister: as R201 on sheet 2_MCU; Value: 220R; PackageReference: 0603; PartID: 541-4047-1-ND; Value3: *
U501 = IC_ADC_ADS8684IDBTR: IC ADC 16BIT SAR 38TSSOP; Manufacturer: Texas Instruments; Value3: TIPD166; Value: ADS8684IDBTR; PackageReference: 38-TSSOP; PartID: 296-39875-1-ND; PartNumber: ADS8684IDBTR
U502-U506 = IC_OPTO_TLP109(TPR,E): OPTOISO 5KV PUSH PULL SO6L; Manufacturer: Toshiba Semiconductor and Storage; Value2: FODM453R2V; Value: TLP109(TPR,E); PackageReference: SO-6; PartID: TLP109(TPRE)CT-ND; PartNumber: TLP109(TPR,E)

## Sheet 4_Digitrol.SchDoc
size A3; DocumentNumber: 5; SheetNumber: 5; SheetTotal: 6
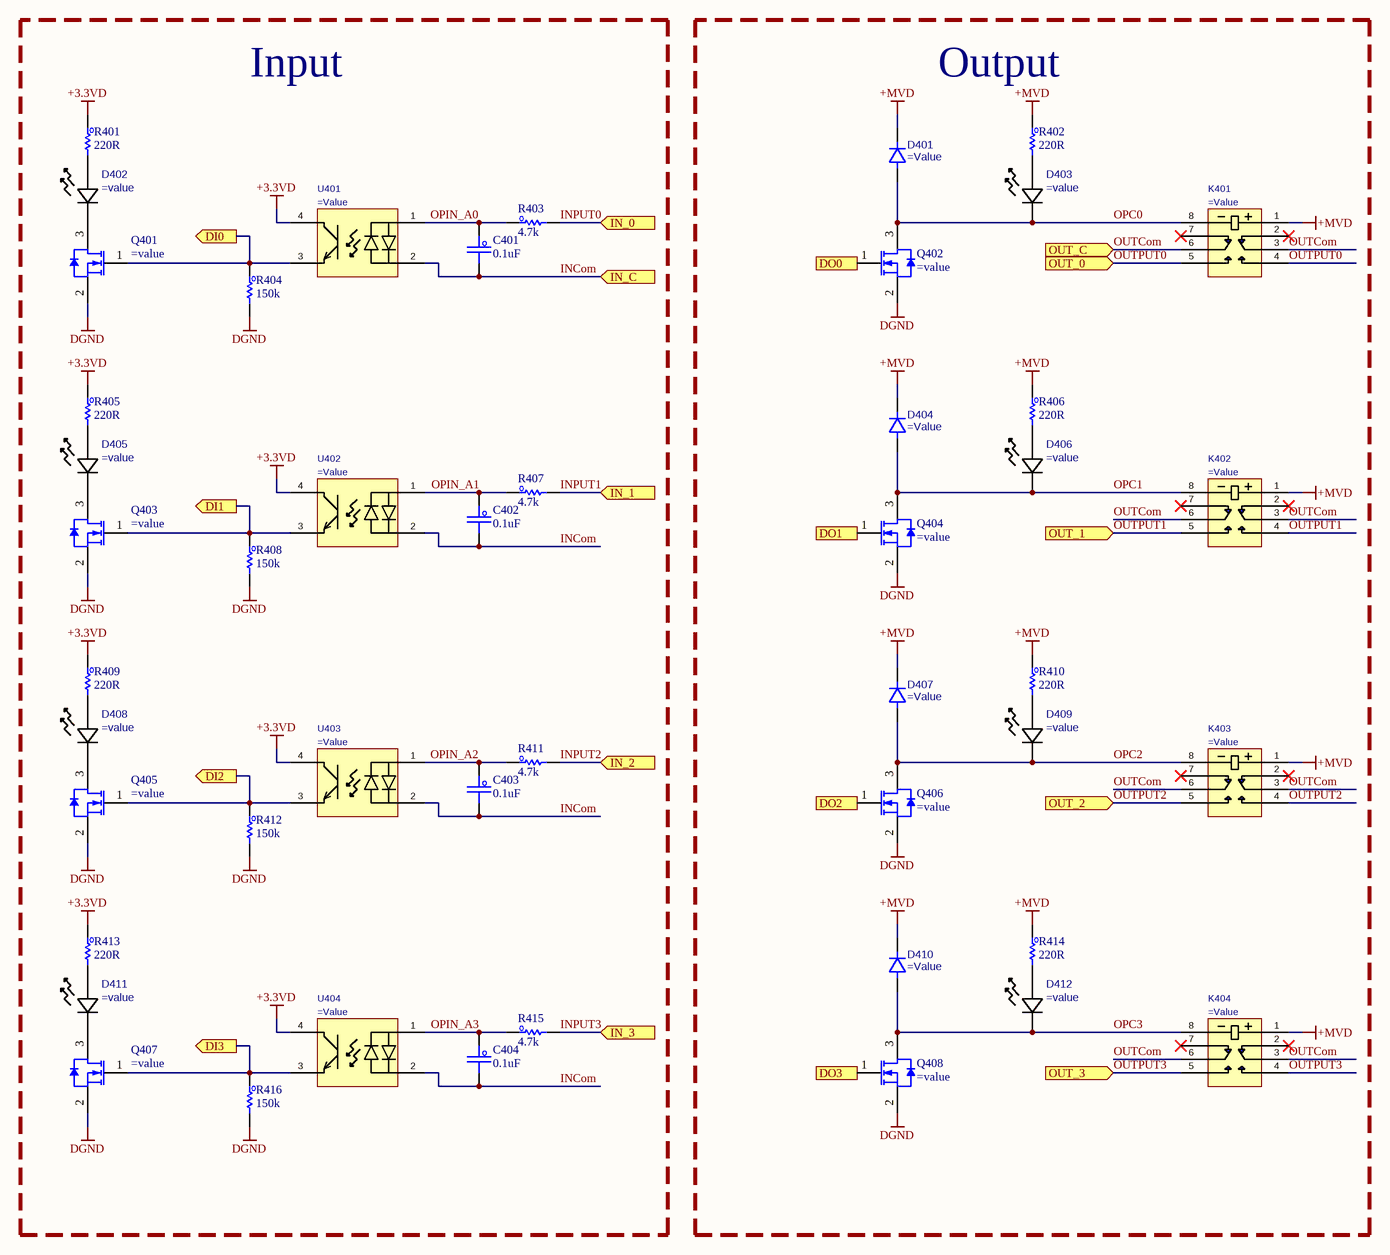
[diagram p3: 4_Digitrol.SchDoc]

### Parts
C401  0.1uF  [C_0603]
C402  0.1uF  [C_0603]
C403  0.1uF  [C_0603]
C404  0.1uF  [C_0603]
D401  (no value)  [SOD323]
D402  (no value)  [LED_0VS75000_WRE]
D403  (no value)  [LED_0VS75000_WRE]
D404  (no value)  [SOD323]
D405  (no value)  [LED_0VS75000_WRE]
D406  (no value)  [LED_0VS75000_WRE]
D407  (no value)  [SOD323]
D408  (no value)  [LED_0VS75000_WRE]
D409  (no value)  [LED_0VS75000_WRE]
D410  (no value)  [SOD323]
D411  (no value)  [LED_0VS75000_WRE]
D412  (no value)  [LED_0VS75000_WRE]
K401  (no value)  [RELAY_HFD4/12-SR]
K402  (no value)  [RELAY_HFD4/12-SR]
K403  (no value)  [RELAY_HFD4/12-SR]
K404  (no value)  [RELAY_HFD4/12-SR]
Q401  (no value)  [TRANS_CSD25481F4]
Q402  (no value)  [TRANS_CSD25481F4]
Q403  (no value)  [TRANS_CSD25481F4]
Q404  (no value)  [TRANS_CSD25481F4]
Q405  (no value)  [TRANS_CSD25481F4]
Q406  (no value)  [TRANS_CSD25481F4]
Q407  (no value)  [TRANS_CSD25481F4]
Q408  (no value)  [TRANS_CSD25481F4]
R401  220R  [R_0603]
R402  220R  [R_0603]
R403  4.7k  [R_0603]
R404  150k  [R_0603]
R405  220R  [R_0603]
R406  220R  [R_0603]
R407  4.7k  [R_0603]
R408  150k  [R_0603]
R409  220R  [R_0603]
R410  220R  [R_0603]
R411  4.7k  [R_0603]
R412  150k  [R_0603]
R413  220R  [R_0603]
R414  220R  [R_0603]
R415  4.7k  [R_0603]
R416  150k  [R_0603]
U401  (no value)  [SOIC_M618A-3T_VI]
U402  (no value)  [SOIC_M618A-3T_VI]
U403  (no value)  [SOIC_M618A-3T_VI]
U404  (no value)  [SOIC_M618A-3T_VI]

### Blocks framed on the sheet
Input: C401-C404 D402 D405 D408 D411 Q401 Q403 Q405 Q407 R401 R403-R405 R407-R409 R411-R413 R415 R416 U401-U404
Output: D401 D403 D404 D406 D407 D409 D410 D412 K401-K404 Q402 Q404 Q406 Q408 R402 R406 R410 R414

### Ports
DI0 (out), DI1 (out), DI2 (out), DI3 (out), DO0 (in), DO1 (in), DO2 (in), DO3 (in), IN_0 (in), IN_1 (in), IN_2 (in), IN_3 (in), IN_C (in), OUT_0 (in), OUT_1 (in), OUT_2 (in), OUT_3 (in), OUT_C (in)

### Nets
+3.3VD: R401.1 R405.1 R409.1 R413.1 U401.4(C) U402.4(C) U403.4(C) U404.4(C)
+MVD: D401.1 D404.1 D407.1 D410.1 K401.1 K402.1 K403.1 K404.1 R402.1 R406.1 R410.1 R414.1
DGND: Q401.2(S) Q402.2(S) Q403.2(S) Q404.2(S) Q405.2(S) Q406.2(S) Q407.2(S) Q408.2(S) R404.2 R408.2 R412.2 R416.2
DIN0: Q401.1(G) R404.1 U401.3(E) ; port DI0
DIN1: Q403.1(G) R408.1 U402.3(E) ; port DI1
DIN2: Q405.1(G) R412.1 U403.3(E) ; port DI2
DIN3: Q407.1(G) R416.1 U404.3(E) ; port DI3
DOUT0: Q402.1(G) ; port DO0
DOUT1: Q404.1(G) ; port DO1
DOUT2: Q406.1(G) ; port DO2
DOUT3: Q408.1(G) ; port DO3
INCom: C401.2 C402.2 C403.2 C404.2 U401.2(C_2) U402.2(C_2) U403.2(C_2) U404.2(C_2) ; port IN_C
INPUT0: R403.2 ; port IN_0
INPUT1: R407.2 ; port IN_1
INPUT2: R411.2 ; port IN_2
INPUT3: R415.2 ; port IN_3
OPC0: D401.2 D403.1 K401.8 Q402.3(D)
OPC1: D404.2 D406.1 K402.8 Q404.3(D)
OPC2: D407.2 D409.1 K403.8 Q406.3(D)
OPC3: D410.2 D412.1 K404.8 Q408.3(D)
OPIN_A0: C401.1 R403.1 U401.1(A)
OPIN_A1: C402.1 R407.1 U402.1(A)
OPIN_A2: C403.1 R411.1 U403.1(A)
OPIN_A3: C404.1 R415.1 U404.1(A)
OUTCom: K401.3 K401.6 K402.3 K402.6 K403.3 K403.6 K404.3 K404.6 ; port OUT_C
OUTPUT0: K401.4 K401.5 ; port OUT_0
OUTPUT1: K402.4 K402.5 ; port OUT_1
OUTPUT2: K403.4 K403.5 ; port OUT_2
OUTPUT3: K404.4 K404.5 ; port OUT_3
NetD402_1: D402.1 Q401.3(D)
NetD402_2: D402.2 R401.2
NetD403_2: D403.2 R402.2
NetD405_1: D405.1 Q403.3(D)
NetD405_2: D405.2 R405.2
NetD406_2: D406.2 R406.2
NetD408_1: D408.1 Q405.3(D)
NetD408_2: D408.2 R409.2
NetD409_2: D409.2 R410.2
NetD411_1: D411.1 Q407.3(D)
NetD411_2: D411.2 R413.2
NetD412_2: D412.2 R414.2

Not connected (* = marked no-connect by the designer): K401 2* 7*; K402 2* 7*; K403 2* 7*; K404 2* 7*

### Notes on the sheet
- Title :
- Revision :
- ผู้จัดทำ:
- Size:
- A3
- Time:
- ผู้เขียน:
- บริษัท ยูนิเวอร์แซล ยูทีลิตี้ส์ จำกัด (มหาชน) เลขที่ 1 อาคาร อีสท์วอเตอร์ ชั้น 18 ซอยวิภาวดีรังสิต 5 แขวงจอมพล เขตจตุจักร กรุงเทพฯ 10900
  Tel : +662-272-1688
  Fax :+662-2721690-1
- -
- Sheet:
- of
- ผู้อำนวยการ
- ผู้ตรวจสอบ:
- Number:
- กรรมการผู้จัดการ:
- File:

### Library data of the parts
C401-C404 = C_Capacitor: as C201 on sheet 2_MCU; PackageReference: 0603; PartID: 399-5089-1-ND; Value2: 50V; Value: 0.1uF; Value3: *
D401 D404 D407 D410 = D_PW_SD103AWS: DIODE SCHOTTKY 40V 2A 0603; Manufacturer: Slkor(SLKORMICRO Elec.); Value: SD103AWS; PackageReference: SOD-323; PartID: C513472; PartNumber: SD103AWS
D402 D403 D405 D406 D408 D409 D411 D412 = D_LED_150060BS75000: as D201 on sheet 2_MCU; PackageReference: 0603; PartID: 732-4980-1-ND; PartNumber: 150060VS75000
K401-K404 = SW_RELAY_HFD4/12-SR: Telecom Non Latching 12VDC DPDT SMD Relays RoHS; Manufacturer: Xiamen Hongfa Electroacoustic; Value: HFD4/5-SR; PackageReference: *; PartID: C64399; PartNumber: HFD4/5-SR
Q401-Q408 = Q_NMOS_CSD17382F4: MOSFET N-CH 30V 2.3A 3PICOSTAR; Manufacturer: Texas Instruments; Value: CSD17382F4; PackageReference: XFDFN-3; PartID: 296-49600-1-ND; PartNumber: CSD17382F4; Value3: *
R401 R402 R405 R406 R409 R410 R413 R414 = R_Resister: as R201 on sheet 2_MCU; Value: 220R; PackageReference: 0603; PartID: 541-4047-1-ND; Value3: *
R403 R407 R411 R415 = R_Resister: RES 4.7K OHM 5% 1/10W 0603; Manufacturer: Vishay Dale; PartNumber: CRCW06034K70JNEBC; Value2: 0.1W; Value: 4.7k; PackageReference: 0603; PartID: 541-CRCW06034K70JNEBCCT-ND; Value3: *
R404 R408 R412 R416 = R_Resister: as R204 on sheet 2_MCU; Value: 150k; PackageReference: 0603; PartID: 541-4034-1-ND; Value3: *
U401-U404 = IC_OPTO_LTV-814S-TA1: OPTOISOLATR 5KV TRANSISTOR 4-SMD; Manufacturer: Lite-On Inc.; Value: LTV-814S-TA1; PackageReference: 4-SOP; PartID: 160-1891-1-ND; PartNumber: LTV-814S-TA1

## Sheet 1_Power.SchDoc
size A3; DocumentNumber: 2; SheetNumber: 2; SheetTotal: 6
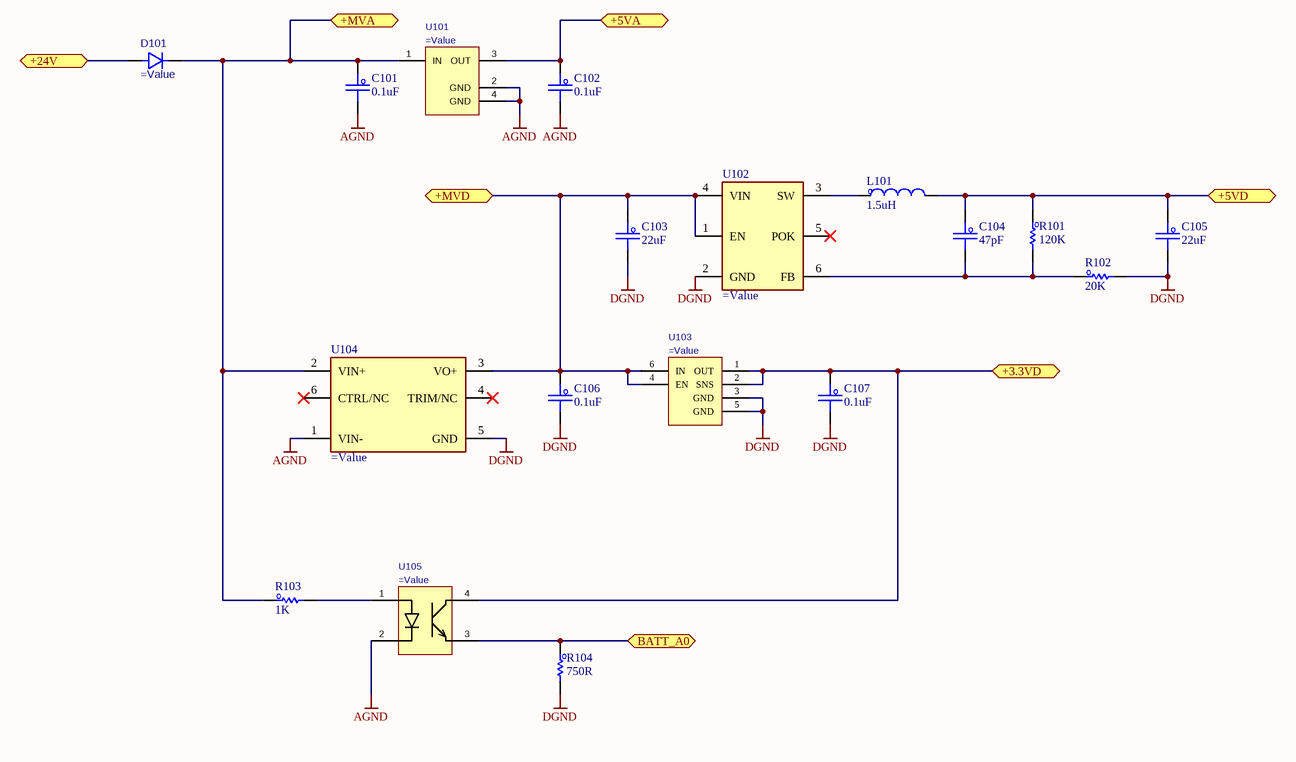
[diagram p4: 1_Power.SchDoc]

### Parts
C101  0.1uF  [C_0603]
C102  0.1uF  [C_0603]
C103  22uF  [C_0603]
C104  47pF  [C_0603]
C105  22uF  [C_0603]
C106  0.1uF  [C_0603]
C107  0.1uF  [C_0603]
D101  (no value)  [SOD323]
L101  1.5uH  [L_0603]
R101  120K  [R_0603]
R102  20K  [R_0603]
R103  1K  [R_0603]
R104  750R  [R_0603]
U101  (no value)  [SOT230P700X180-4N]
U102  (no value)  [SOT95P270X115-6M]
U103  (no value)  [SON65P200X200X80-7N]
U104  (no value)  [CONV_HLK-20D2405]
U105  (no value)  [SOIC_M618A-3T_VI]

### Ports
+3.3VD (bidir), +5VA (bidir), +5VD (bidir), +24V (bidir), +MVA (bidir), +MVD (bidir), BATT_A0 (bidir)

### Nets
+3.3VD: C107.1 U103.1(OUT) U103.2(SNS) U105.4(C) ; port +3.3VD
+5VA: C102.1 U101.3(OUT) ; port +5VA
+5VD: C104.1 C105.1 L101.2 R101.1 ; port +5VD
+24V: D101.2 ; port +24V
+MVA: C101.1 D101.1 R103.1 U101.1(IN) U104.2(VIN+) ; port +MVA
+MVD: C103.1 C106.1 U102.1(EN) U102.4(VIN) U103.4(EN) U103.6(IN) U104.3(VO+) ; port +MVD
AGND: C101.2 C102.2 U101.2(GND) U101.4(GND) U104.1(VIN-) U105.2(C_2)
DGND: C103.2 C105.2 C106.2 C107.2 R102.2 R104.2 U102.2(GND) U103.3(GND) U103.5(GND) U104.5(GND)
Fuelgauge: R104.1 U105.3(E) ; port BATT_A0
NetC104_2: C104.2 R101.2 R102.1 U102.6(FB)
NetL101_1: L101.1 U102.3(SW)
NetR103_2: R103.2 U105.1(A)

Not connected (* = marked no-connect by the designer): U102 5(POK)*; U104 4(TRIM/NC)* 6(CTRL/NC)*

### Notes on the sheet
- Title :
- Revision :
- ผู้จัดทำ:
- Size:
- A3
- Time:
- ผู้เขียน:
- บริษัท ยูนิเวอร์แซล ยูทีลิตี้ส์ จำกัด (มหาชน) เลขที่ 1 อาคาร อีสท์วอเตอร์ ชั้น 18 ซอยวิภาวดีรังสิต 5 แขวงจอมพล เขตจตุจักร กรุงเทพฯ 10900
  Tel : +662-272-1688
  Fax :+662-2721690-1
- -
- Sheet:
- of
- ผู้อำนวยการ
- ผู้ตรวจสอบ:
- Number:
- กรรมการผู้จัดการ:
- File:

### Library data of the parts
C101 C102 C106 C107 = C_Capacitor: as C201 on sheet 2_MCU; PackageReference: 0603; PartID: 399-5089-1-ND; Value2: 50V; Value: 0.1uF; Value3: *
C103 C105 = C_Capacitor: CAP CER 22UF 10V X5R 0603; Manufacturer: TDK Corporation; PartNumber: C1608X5R1A226M080AC; PackageReference: 0603; PartID: 445-9077-1-ND; Value2: 10V; Value: 22uF; Value3: *
C104 = C_Capacitor: CAP CER 47PF 50V X7R 0603; Manufacturer: KEMET; PartNumber: C0603C470J5RAC7867; PackageReference: 0603; PartID: 399-C0603C470J5RAC7867CT-ND; Value2: 50V; Value: 47pF; Value3: *
D101 = D_PW_SD103AWS: as D401 on sheet 4_Digitrol; Value: SD103AWS; PackageReference: SOD-323; PartID: C513472; PartNumber: SD103AWS
L101 = L_Inductor: 1.5 µH Shielded Wirewound Inductor 1 A 200mOhm Max 0603 (1608 Metric); Manufacturer: Taiyo Yuden; PartNumber: MBKK1608T1R5M; Value2: 1Mhz; Value: 1.5uH; PackageReference: 0603; PartID: 587-4149-1-ND; Value3: *
R101 = R_Resister: RES 120K OHM 5% 1/10W 0603; Manufacturer: YAGEO; PartNumber: RC0603JR-07120KL; Value2: 0.1W; Value: 120K; PackageReference: 0603; PartID: 311-120KGRCT-ND; Value3: *
R102 = R_Resister: RES 20K OHM 1% 1/10W 0603; Manufacturer: YAGEO; PartNumber: RC0603FR-0720KL; Value2: 0.1W; Value: 20K; PackageReference: 0603; PartID: 311-20.0KHRCT-ND; Value3: *
R103 = R_Resister: as R501 on sheet 5_Analog; Value: 1K; PackageReference: 0603; PartID: 541-1.0KGCT-ND; Value3: *
R104 = R_Resister: RES 715 OHM 0.1% 0.15W 0603; Manufacturer: Vishay Dale; PartNumber: RCS0603750RFKEA; Value2: 0.25W; Value: 750R; PackageReference: 0603; PartID: 541-10491-1-ND; Value3: *
U101 = IC_LDO_UA78M05QDCYRG4Q1: IC REG LINEAR 5V 500MA SOT223-4; Manufacturer: Texas Instruments; PartNumber: UA78M05QDCYRG4Q1; PackageReference: SOT-223-4; PartID: 296-22950-1-ND; Value: UA78M05QDCYRG4Q1
U102 = IC_PMS_JW5222: DC DC CONVERTER 5V 5W; PartNumber: JW5222; Manufacturer: JoulWatt Tech; Value: JW5222; PartID: C371424; PackageReference: SOT-23-5; Value2: *; Value3: *
U103 = IC_LDO_TLV76733DRVR: IC REG LINEAR 3.3V 1A 6WSON; Manufacturer: Texas Instruments; PartNumber: TLV76733DRVR; PackageReference: DCY0004A; PartID: 296-TLV76733DRVRCT-ND; Value: TLV76733DRVR
U104 = IC_PMS_HLK-X0D2405: 20W DC/DC IN 9-36V OUT 5V; Manufacturer: HI-LINK; Value: HLK-10D2405; PackageReference: *; PartID: C2761163; PartNumber: HLK-10D2405
U105 = IC_OPTO_VOM618A-3T: OPTOISOLATOR 3.75KV TRANS 4-SOP; Manufacturer: Vishay; Value: VOM618A-3T; PackageReference: 4-SOP; PartID: VOM618A-3CT-ND; PartNumber: VOM618A-3T

## Sheet 3_BackBone.SchDoc
size A3; DocumentNumber: 4; SheetNumber: 4; SheetTotal: 6
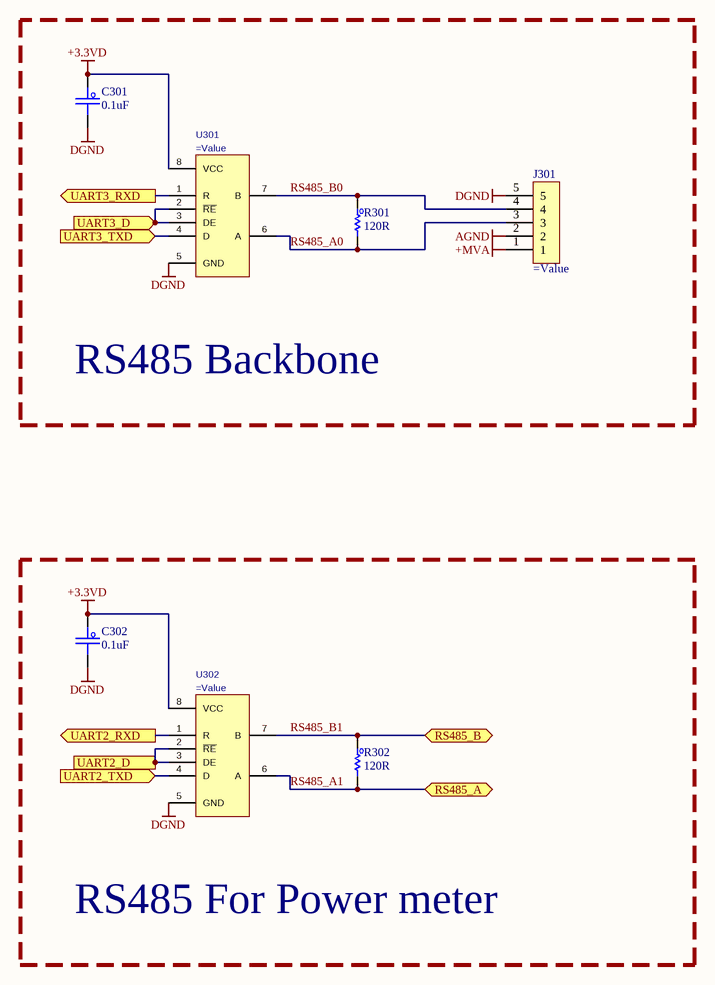
[diagram p5: 3_BackBone.SchDoc]

### Parts
C301  0.1uF  [C_0603]  (no BOM)
C302  0.1uF  [C_0603]
J301  (no value)  [CON_9155005541006]  (no BOM)
R301  120R  [R_0603]  (no BOM)
R302  120R  [R_0603]
U301  (no value)  [D0008A_L]  (no BOM)
U302  (no value)  [D0008A_L]

### Blocks framed on the sheet
RS485 Backbone: C301 J301 R301 U301
RS485 For Power meter: C302 R302 U302

### Ports
RS485_A (bidir), RS485_B (bidir), UART2_D (in), UART2_RXD (out), UART2_TXD (in), UART3_D (in), UART3_RXD (out), UART3_TXD (in)

### Nets
+3.3VD: C301.1 C302.1 U301.8(VCC) U302.8(VCC)
+MVA: J301.1
AGND: J301.2
DGND: C301.2 C302.2 J301.5 U301.5(GND) U302.5(GND)
BackBone_D: U301.2(~{RE}) U301.3(DE) ; port UART3_D
BackBone_RX: U301.1(R) ; port UART3_RXD
BackBone_TX: U301.4(D) ; port UART3_TXD
RS485_A0: J301.3 R301.2 U301.6(A)
RS485_A1: R302.2 U302.6(A) ; port RS485_A  [project net RS485_A]
RS485_B0: J301.4 R301.1 U301.7(B)
RS485_B1: R302.1 U302.7(B) ; port RS485_B  [project net RS485_B]
RS485_D: U302.2(~{RE}) U302.3(DE) ; port UART2_D
RS485_RX: U302.1(R) ; port UART2_RXD
RS485_TX: U302.4(D) ; port UART2_TXD

### Notes on the sheet
- Title :
- Revision :
- ผู้จัดทำ:
- Size:
- A3
- Time:
- ผู้เขียน:
- บริษัท ยูนิเวอร์แซล ยูทีลิตี้ส์ จำกัด (มหาชน) เลขที่ 1 อาคาร อีสท์วอเตอร์ ชั้น 18 ซอยวิภาวดีรังสิต 5 แขวงจอมพล เขตจตุจักร กรุงเทพฯ 10900
  Tel : +662-272-1688
  Fax :+662-2721690-1
- -
- Sheet:
- of
- ผู้อำนวยการ
- ผู้ตรวจสอบ:
- Number:
- กรรมการผู้จัดการ:
- File:

### Library data of the parts
C301 C302 = C_Capacitor: as C201 on sheet 2_MCU; PackageReference: 0603; PartID: 399-5089-1-ND; Value2: 50V; Value: 0.1uF; Value3: *
J301 = CON_5P_9155005541006: CONN SPRING BATTERY 5POS R/A SMD; PartNumber: 009155005541006; Manufacturer: AVX; Value: 009155005541006; PartID: 478-5453-1-ND; PackageReference: *; Value2: *; Value3: *
R301 R302 = R_Resister: RES SMD 120 OHM 1% 1/3W 0603; Manufacturer: Vishay Dale; PartNumber: CRCW0603120RFKEAHP; Value2: 0.333W; Value: 120R; PackageReference: 0603; PartID: 541-120SCT-ND; Value3: *
U301 U302 = IC_TRAN_THVD1505DR: IC TRANSCEIVER HALF 1/1 8SOIC; Manufacturer: Texas Instruments; PartNumber: SN65HVD11DR; Value: SN65HVD11DR; Value3: SN65HVD1780QDRQ1; PackageReference: 8SOIC; PartID: 0086-0766-1

## Nets that join several sheets
+3.3VD: 2_MCU (25 pins), 5_Analog (7 pins), 4_Digitrol (8 pins), 1_Power (C107.1 U103.1 U103.2 U105.4), 3_BackBone (C301.1 C302.1 U301.8 U302.8)
+5VA: 5_Analog (21 pins), 1_Power (C102.1 U101.3)
+5VD: 2_MCU (6 pins), 1_Power (C104.1 C105.1 L101.2 R101.1)
+24V: 0_Overview (J2.1), 1_Power (D101.2)
+MVA: 0_Overview (J1.11 J2.3 J2.7), 1_Power (5 pins), 3_BackBone (J301.1)
+MVD: 4_Digitrol (12 pins), 1_Power (7 pins)
AGND: 0_Overview (5 pins), 5_Analog (23 pins), 1_Power (6 pins), 3_BackBone (J301.2)
DGND: 0_Overview (C1.2 J3.5), 2_MCU (47 pins), 5_Analog (C516.2 U506.4), 4_Digitrol (12 pins), 1_Power (10 pins), 3_BackBone (5 pins)
BackBone_D: 2_MCU (TP230.1 U201.39), 3_BackBone (U301.2 U301.3)
BackBone_RX: 2_MCU (TP216.1 U201.46), 3_BackBone (U301.1)
BackBone_TX: 2_MCU (TP218.1 U201.44), 3_BackBone (U301.4)
DIN0: 2_MCU (TP204.1 U201.3), 4_Digitrol (Q401.1 R404.1 U401.3)
DIN1: 2_MCU (TP241.1 U201.4), 4_Digitrol (Q403.1 R408.1 U402.3)
DIN2: 2_MCU (TP206.1 U201.5), 4_Digitrol (Q405.1 R412.1 U403.3)
DIN3: 2_MCU (TP242.1 U201.6), 4_Digitrol (Q407.1 R416.1 U404.3)
DoorIn0: 0_Overview (J3.3), 2_MCU (U201.94)
DoorIn1: 0_Overview (J3.4), 2_MCU (U201.99)
DoorOut0: 0_Overview (J3.2), 2_MCU (U201.93)
DoorOut1: 0_Overview (J3.1), 2_MCU (U201.92)
DOUT0: 2_MCU (TP209.1 U201.7), 4_Digitrol (Q402.1)
DOUT1: 2_MCU (TP243.1 U201.8), 4_Digitrol (Q404.1)
DOUT2: 2_MCU (TP211.1 U201.9), 4_Digitrol (Q406.1)
DOUT3: 2_MCU (TP240.1 U201.13), 4_Digitrol (Q408.1)
Fuelgauge: 2_MCU (TP226.1 U201.12), 1_Power (R104.1 U105.3)
INCom: 0_Overview (J1.1), 4_Digitrol (8 pins)
INPUT0: 0_Overview (J1.2), 4_Digitrol (R403.2)
INPUT1: 0_Overview (J1.3), 4_Digitrol (R407.2)
INPUT2: 0_Overview (J1.4), 4_Digitrol (R411.2)
INPUT3: 0_Overview (J1.5), 4_Digitrol (R415.2)
NetJ1_13: 0_Overview (J1.13), 5_Analog (R501.2 R502.1)
NetJ1_14: 0_Overview (J1.14), 5_Analog (R502.2 R503.2)
NetJ1_15: 0_Overview (J1.15), 5_Analog (R504.2 R510.1)
NetJ1_16: 0_Overview (J1.16), 5_Analog (R510.2 R511.2)
NetJ1_17: 0_Overview (J1.17), 5_Analog (R513.2 R515.1)
NetJ1_18: 0_Overview (J1.18), 5_Analog (R515.2 R516.2)
NetJ1_19: 0_Overview (J1.19), 5_Analog (R518.2 R520.1)
NetJ1_20: 0_Overview (J1.20), 5_Analog (R520.2 R521.2)
OUTCom: 0_Overview (J1.6), 4_Digitrol (8 pins)
OUTPUT0: 0_Overview (J1.7), 4_Digitrol (K401.4 K401.5)
OUTPUT1: 0_Overview (J1.8), 4_Digitrol (K402.4 K402.5)
OUTPUT2: 0_Overview (J1.9), 4_Digitrol (K403.4 K403.5)
OUTPUT3: 0_Overview (J1.10), 4_Digitrol (K404.4 K404.5)
RS485_A: 0_Overview (J2.4 J2.8), 3_BackBone (R302.2 U302.6)
RS485_B: 0_Overview (J2.5 J2.9), 3_BackBone (R302.1 U302.7)
RS485_D: 2_MCU (TP229.1 U201.22), 3_BackBone (U302.2 U302.3)
RS485_RX: 2_MCU (TP227.1 U201.15), 3_BackBone (U302.1)
RS485_TX: 2_MCU (TP228.1 U201.20), 3_BackBone (U302.4)
SPI1_CSADC: 2_MCU (TP219.1 U201.42), 5_Analog (U505.3)
SPI1_MISO: 2_MCU (TP220.1 U201.41), 5_Analog (R523.1 U506.5)
SPI1_MOSI: 2_MCU (TP221.1 U201.33), 5_Analog (U502.3)
SPI1_SCK: 2_MCU (TP222.1 U201.31), 5_Analog (U504.3)
SPI_Reset: 2_MCU (TP224.1 U201.28), 5_Analog (U503.3)